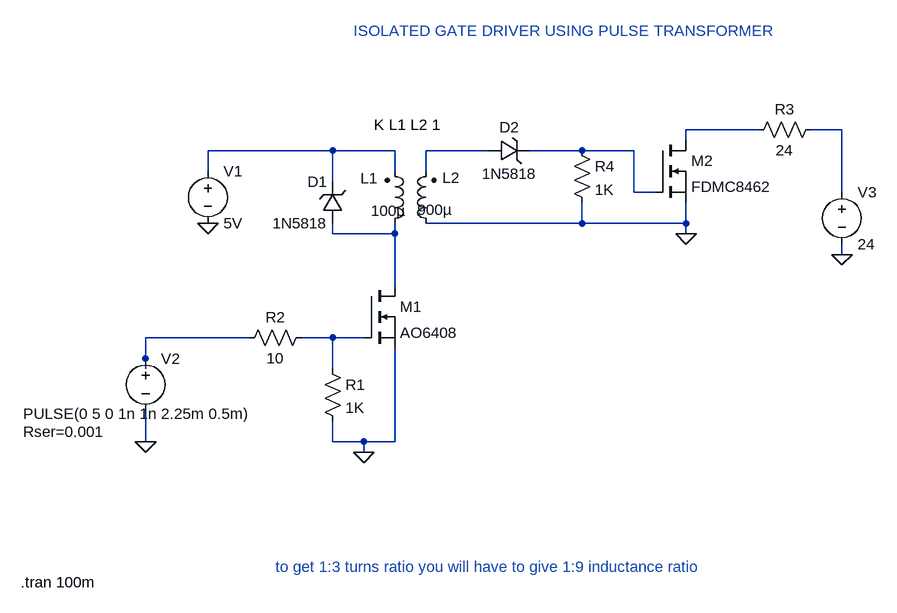
[diagram p0: schematic isolated gate driver using pulse transformer.asc]
isolated gate driver using pulse transformer.asc, the LTspice schematic file:
Version 4.1
SHEET 1 904 744
WIRE 720 32 608 32
WIRE 848 32 800 32
WIRE 608 48 608 32
WIRE 64 64 -128 64
WIRE 160 64 64 64
WIRE 304 64 208 64
WIRE 448 64 368 64
WIRE 528 64 448 64
WIRE -128 96 -128 64
WIRE 160 96 160 64
WIRE 208 96 208 64
WIRE 64 112 64 64
WIRE 528 128 528 64
WIRE 560 128 528 128
WIRE 848 128 848 32
WIRE 448 176 448 144
WIRE 448 176 208 176
WIRE 608 176 608 144
WIRE 608 176 448 176
WIRE 64 192 64 176
WIRE 160 192 160 176
WIRE 160 192 64 192
WIRE 608 192 608 176
WIRE 848 224 848 208
WIRE 160 272 160 192
WIRE -64 352 -224 352
WIRE 64 352 16 352
WIRE 112 352 64 352
WIRE -224 384 -224 352
WIRE -224 400 -224 384
WIRE 64 400 64 352
WIRE -224 512 -224 464
WIRE 64 512 64 480
WIRE 112 512 64 512
WIRE 160 512 160 368
WIRE 160 512 112 512
WIRE 112 528 112 512
FLAG -128 176 0
FLAG -224 512 0
FLAG 112 528 0
FLAG 608 192 0
FLAG 848 224 0
SYMBOL ind2 144 192 M180
WINDOW 0 -37 85 Left 2
WINDOW 3 -21 35 Left 2
SYMATTR InstName L1
SYMATTR Value 100µ
SYMBOL ind2 224 192 R180
WINDOW 0 -36 86 Left 2
WINDOW 3 -25 37 Left 2
SYMATTR InstName L2
SYMATTR Value 900µ
SYMBOL zener 80 176 R180
WINDOW 0 24 64 Left 2
WINDOW 3 24 0 Left 2
SYMATTR InstName D1
SYMATTR Value 1N5818
SYMBOL voltage -128 80 R0
WINDOW 123 0 0 Left 0
WINDOW 39 0 0 Left 0
SYMATTR InstName V1
SYMATTR Value 5V
SYMBOL nmos 112 272 R0
SYMATTR InstName M1
SYMATTR Value AO6408
SYMBOL res 48 384 R0
SYMATTR InstName R1
SYMATTR Value 1K
SYMBOL res 32 336 R90
WINDOW 0 0 56 VBottom 2
WINDOW 3 32 56 VTop 2
SYMATTR InstName R2
SYMATTR Value 10
SYMBOL voltage -224 368 R0
WINDOW 3 -188 101 Left 2
WINDOW 123 0 0 Left 0
WINDOW 39 -188 129 Left 2
SYMATTR InstName V2
SYMATTR Value PULSE(0 5 0 1n 1n 2.25m 0.5m)
SYMATTR SpiceLine Rser=0.001
SYMBOL zener 304 80 R270
WINDOW 0 36 32 VTop 2
WINDOW 3 -4 32 VBottom 2
SYMATTR InstName D2
SYMATTR Value 1N5818
SYMBOL nmos 560 48 R0
SYMATTR InstName M2
SYMATTR Value FDMC8462
SYMBOL voltage 848 112 R0
WINDOW 123 0 0 Left 0
WINDOW 39 0 0 Left 0
SYMATTR InstName V3
SYMATTR Value 24
SYMBOL res 816 16 R90
WINDOW 0 0 56 VBottom 2
WINDOW 3 32 56 VTop 2
SYMATTR InstName R3
SYMATTR Value 24
SYMBOL res 432 48 R0
SYMATTR InstName R4
SYMATTR Value 1K
TEXT 96 -120 Left 2 ;ISOLATED GATE DRIVER USING PULSE TRANSFORMER
TEXT -24 704 Left 2 ;to get 1:3 turns ratio you will have to give 1:9 inductance ratio
TEXT 128 24 Left 2 !K L1 L2 1
TEXT -416 728 Left 2 !.tran 100m

The netlist it stands for:
* isolated gate driver using pulse transformer.asc
L1 N006 N003 100µ
L2 0 N004 900µ
D1 N006 N003 1N5818
V1 N003 0 5V
M1 N006 N008 0 0 AO6408
R1 N008 0 1K
R2 N008 N007 10
V2 N007 0 PULSE(0 5 0 1n 1n 2.25m 0.5m) Rser=0.001
D2 N004 N005 1N5818
M2 N001 N005 0 0 FDMC8462
V3 N002 0 24
R3 N002 N001 24
R4 N005 0 1K
.model D D
.lib standard.dio
.model NMOS NMOS
.model PMOS PMOS
.lib standard.mos
* ISOLATED GATE DRIVER USING PULSE TRANSFORMER
* to get 1:3 turns ratio you will have to give 1:9 inductance ratio
K L1 L2 1
.tran 100m
.backanno
.end